# Altium project FIT_PM_Digital_Readout_test_board.PrjPcb (part 2 of 4)

## Sheet ADC5G_DIGITALIO.SchDoc: FMC 5GS/s ADC/TDC
size 420 x 297 mm; Author: Agnieszka Bartkowicz; CompanyName: WUT ISE; DrawnBy: Agnieszka Bartkowicz; Engineer: Agnieszka Bartkowicz; Organization: WUT ISE; Address1: PW ISE; Address2: Nowowiejska 15/19 00-665 Warsaw; Address3: gyorka@o2.pl; SheetNumber: 4; SheetTotal: 13; ModifiedBy: -; CheckedDate: -; Title2: Title 2; DivGrp: WUT ISE; Designer: A. Bartkowicz
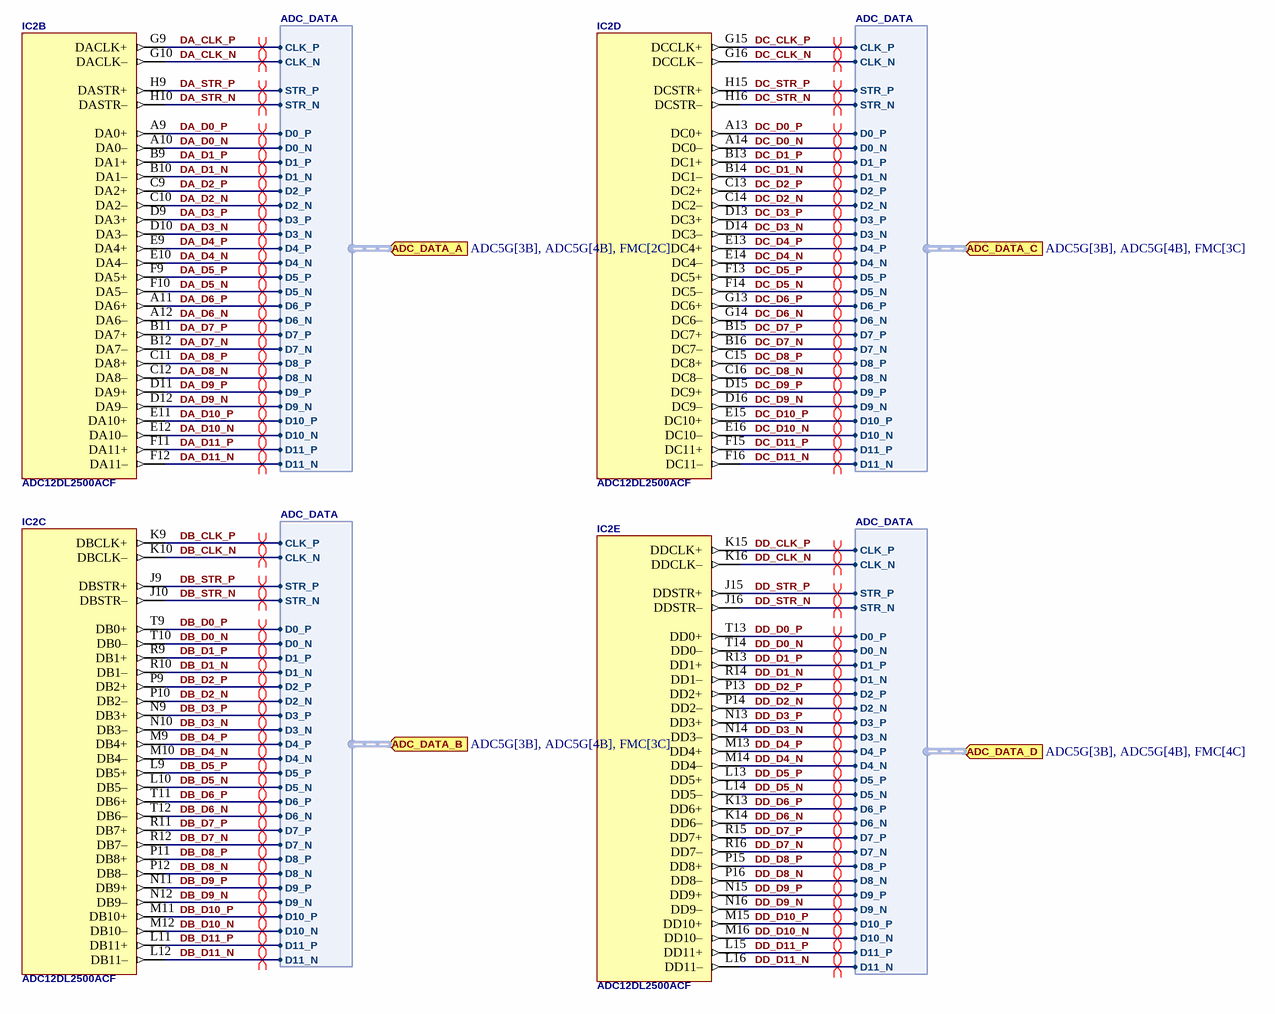
[diagram p4: ADC5G_DIGITALIO.SchDoc]

### Parts
IC2  ADC12DL2500ACF  [BGA256C100P16X16_1700X1700X331]  (parts B,C,D,E of 7)

### Ports
ADC_DATA_A (in, harness ADC_DATA, see ADC5G[3B], ADC5G[4B], FMC[2C]), ADC_DATA_B (in, harness ADC_DATA, see ADC5G[3B], ADC5G[4B], FMC[3C]), ADC_DATA_C (in, harness ADC_DATA, see ADC5G[3B], ADC5G[4B], FMC[3C]), ADC_DATA_D (in, harness ADC_DATA, see ADC5G[3B], ADC5G[4B], FMC[4C])

### Harnesses
ADC_DATA: CLK_P, CLK_N, STR_P, STR_N, D0_P, D1_P, D2_P, D3_P, D4_P, D5_P, D6_P, D7_P, D8_P, D9_P, D10_P, D11_P, D11_N, D10_N, D9_N, D8_N, D7_N, D6_N, D5_N, D4_N, D3_N, D2_N, D1_N, D0_N

### Nets
DA_CLK_N: IC2.G10(DACLK–) ; port ADC_DATA_A.CLK_N
DA_CLK_P: IC2.G9(DACLK+) ; port ADC_DATA_A.CLK_P
DA_D0_N: IC2.A10(DA0–) ; port ADC_DATA_A.D0_N
DA_D0_P: IC2.A9(DA0+) ; port ADC_DATA_A.D0_P
DA_D1_N: IC2.B10(DA1–) ; port ADC_DATA_A.D1_N
DA_D1_P: IC2.B9(DA1+) ; port ADC_DATA_A.D1_P
DA_D2_N: IC2.C10(DA2–) ; port ADC_DATA_A.D2_N
DA_D2_P: IC2.C9(DA2+) ; port ADC_DATA_A.D2_P
DA_D3_N: IC2.D10(DA3–) ; port ADC_DATA_A.D3_N
DA_D3_P: IC2.D9(DA3+) ; port ADC_DATA_A.D3_P
DA_D4_N: IC2.E10(DA4–) ; port ADC_DATA_A.D4_N
DA_D4_P: IC2.E9(DA4+) ; port ADC_DATA_A.D4_P
DA_D5_N: IC2.F10(DA5–) ; port ADC_DATA_A.D5_N
DA_D5_P: IC2.F9(DA5+) ; port ADC_DATA_A.D5_P
DA_D6_N: IC2.A12(DA6–) ; port ADC_DATA_A.D6_N
DA_D6_P: IC2.A11(DA6+) ; port ADC_DATA_A.D6_P
DA_D7_N: IC2.B12(DA7–) ; port ADC_DATA_A.D7_N
DA_D7_P: IC2.B11(DA7+) ; port ADC_DATA_A.D7_P
DA_D8_N: IC2.C12(DA8–) ; port ADC_DATA_A.D8_N
DA_D8_P: IC2.C11(DA8+) ; port ADC_DATA_A.D8_P
DA_D9_N: IC2.D12(DA9–) ; port ADC_DATA_A.D9_N
DA_D9_P: IC2.D11(DA9+) ; port ADC_DATA_A.D9_P
DA_D10_N: IC2.E12(DA10–) ; port ADC_DATA_A.D10_N
DA_D10_P: IC2.E11(DA10+) ; port ADC_DATA_A.D10_P
DA_D11_N: IC2.F12(DA11–) ; port ADC_DATA_A.D11_N
DA_D11_P: IC2.F11(DA11+) ; port ADC_DATA_A.D11_P
DA_STR_N: IC2.H10(DASTR–) ; port ADC_DATA_A.STR_N
DA_STR_P: IC2.H9(DASTR+) ; port ADC_DATA_A.STR_P
DB_CLK_N: IC2.K10(DBCLK–) ; port ADC_DATA_B.CLK_N
DB_CLK_P: IC2.K9(DBCLK+) ; port ADC_DATA_B.CLK_P
DB_D0_N: IC2.T10(DB0–) ; port ADC_DATA_B.D0_N
DB_D0_P: IC2.T9(DB0+) ; port ADC_DATA_B.D0_P
DB_D1_N: IC2.R10(DB1–) ; port ADC_DATA_B.D1_N
DB_D1_P: IC2.R9(DB1+) ; port ADC_DATA_B.D1_P
DB_D2_N: IC2.P10(DB2–) ; port ADC_DATA_B.D2_N
DB_D2_P: IC2.P9(DB2+) ; port ADC_DATA_B.D2_P
DB_D3_N: IC2.N10(DB3–) ; port ADC_DATA_B.D3_N
DB_D3_P: IC2.N9(DB3+) ; port ADC_DATA_B.D3_P
DB_D4_N: IC2.M10(DB4–) ; port ADC_DATA_B.D4_N
DB_D4_P: IC2.M9(DB4+) ; port ADC_DATA_B.D4_P
DB_D5_N: IC2.L10(DB5–) ; port ADC_DATA_B.D5_N
DB_D5_P: IC2.L9(DB5+) ; port ADC_DATA_B.D5_P
DB_D6_N: IC2.T12(DB6–) ; port ADC_DATA_B.D6_N
DB_D6_P: IC2.T11(DB6+) ; port ADC_DATA_B.D6_P
DB_D7_N: IC2.R12(DB7–) ; port ADC_DATA_B.D7_N
DB_D7_P: IC2.R11(DB7+) ; port ADC_DATA_B.D7_P
DB_D8_N: IC2.P12(DB8–) ; port ADC_DATA_B.D8_N
DB_D8_P: IC2.P11(DB8+) ; port ADC_DATA_B.D8_P
DB_D9_N: IC2.N12(DB9–) ; port ADC_DATA_B.D9_N
DB_D9_P: IC2.N11(DB9+) ; port ADC_DATA_B.D9_P
DB_D10_N: IC2.M12(DB10–) ; port ADC_DATA_B.D10_N
DB_D10_P: IC2.M11(DB10+) ; port ADC_DATA_B.D10_P
DB_D11_N: IC2.L12(DB11–) ; port ADC_DATA_B.D11_N
DB_D11_P: IC2.L11(DB11+) ; port ADC_DATA_B.D11_P
DB_STR_N: IC2.J10(DBSTR–) ; port ADC_DATA_B.STR_N
DB_STR_P: IC2.J9(DBSTR+) ; port ADC_DATA_B.STR_P
DC_CLK_N: IC2.G16(DCCLK–) ; port ADC_DATA_C.CLK_N
DC_CLK_P: IC2.G15(DCCLK+) ; port ADC_DATA_C.CLK_P
DC_D0_N: IC2.A14(DC0–) ; port ADC_DATA_C.D0_N
DC_D0_P: IC2.A13(DC0+) ; port ADC_DATA_C.D0_P
DC_D1_N: IC2.B14(DC1–) ; port ADC_DATA_C.D1_N
DC_D1_P: IC2.B13(DC1+) ; port ADC_DATA_C.D1_P
DC_D2_N: IC2.C14(DC2–) ; port ADC_DATA_C.D2_N
DC_D2_P: IC2.C13(DC2+) ; port ADC_DATA_C.D2_P
DC_D3_N: IC2.D14(DC3–) ; port ADC_DATA_C.D3_N
DC_D3_P: IC2.D13(DC3+) ; port ADC_DATA_C.D3_P
DC_D4_N: IC2.E14(DC4–) ; port ADC_DATA_C.D4_N
DC_D4_P: IC2.E13(DC4+) ; port ADC_DATA_C.D4_P
DC_D5_N: IC2.F14(DC5–) ; port ADC_DATA_C.D5_N
DC_D5_P: IC2.F13(DC5+) ; port ADC_DATA_C.D5_P
DC_D6_N: IC2.G14(DC6–) ; port ADC_DATA_C.D6_N
DC_D6_P: IC2.G13(DC6+) ; port ADC_DATA_C.D6_P
DC_D7_N: IC2.B16(DC7–) ; port ADC_DATA_C.D7_N
DC_D7_P: IC2.B15(DC7+) ; port ADC_DATA_C.D7_P
DC_D8_N: IC2.C16(DC8–) ; port ADC_DATA_C.D8_N
DC_D8_P: IC2.C15(DC8+) ; port ADC_DATA_C.D8_P
DC_D9_N: IC2.D16(DC9–) ; port ADC_DATA_C.D9_N
DC_D9_P: IC2.D15(DC9+) ; port ADC_DATA_C.D9_P
DC_D10_N: IC2.E16(DC10–) ; port ADC_DATA_C.D10_N
DC_D10_P: IC2.E15(DC10+) ; port ADC_DATA_C.D10_P
DC_D11_N: IC2.F16(DC11–) ; port ADC_DATA_C.D11_N
DC_D11_P: IC2.F15(DC11+) ; port ADC_DATA_C.D11_P
DC_STR_N: IC2.H16(DCSTR–) ; port ADC_DATA_C.STR_N
DC_STR_P: IC2.H15(DCSTR+) ; port ADC_DATA_C.STR_P
DD_CLK_N: IC2.K16(DDCLK–) ; port ADC_DATA_D.CLK_N
DD_CLK_P: IC2.K15(DDCLK+) ; port ADC_DATA_D.CLK_P
DD_D0_N: IC2.T14(DD0–) ; port ADC_DATA_D.D0_N
DD_D0_P: IC2.T13(DD0+) ; port ADC_DATA_D.D0_P
DD_D1_N: IC2.R14(DD1–) ; port ADC_DATA_D.D1_N
DD_D1_P: IC2.R13(DD1+) ; port ADC_DATA_D.D1_P
DD_D2_N: IC2.P14(DD2–) ; port ADC_DATA_D.D2_N
DD_D2_P: IC2.P13(DD2+) ; port ADC_DATA_D.D2_P
DD_D3_N: IC2.N14(DD3–) ; port ADC_DATA_D.D3_N
DD_D3_P: IC2.N13(DD3+) ; port ADC_DATA_D.D3_P
DD_D4_N: IC2.M14(DD4–) ; port ADC_DATA_D.D4_N
DD_D4_P: IC2.M13(DD4+) ; port ADC_DATA_D.D4_P
DD_D5_N: IC2.L14(DD5–) ; port ADC_DATA_D.D5_N
DD_D5_P: IC2.L13(DD5+) ; port ADC_DATA_D.D5_P
DD_D6_N: IC2.K14(DD6–) ; port ADC_DATA_D.D6_N
DD_D6_P: IC2.K13(DD6+) ; port ADC_DATA_D.D6_P
DD_D7_N: IC2.R16(DD7–) ; port ADC_DATA_D.D7_N
DD_D7_P: IC2.R15(DD7+) ; port ADC_DATA_D.D7_P
DD_D8_N: IC2.P16(DD8–) ; port ADC_DATA_D.D8_N
DD_D8_P: IC2.P15(DD8+) ; port ADC_DATA_D.D8_P
DD_D9_N: IC2.N16(DD9–) ; port ADC_DATA_D.D9_N
DD_D9_P: IC2.N15(DD9+) ; port ADC_DATA_D.D9_P
DD_D10_N: IC2.M16(DD10–) ; port ADC_DATA_D.D10_N
DD_D10_P: IC2.M15(DD10+) ; port ADC_DATA_D.D10_P
DD_D11_N: IC2.L16(DD11–) ; port ADC_DATA_D.D11_N
DD_D11_P: IC2.L15(DD11+) ; port ADC_DATA_D.D11_P
DD_STR_N: IC2.J16(DDSTR–) ; port ADC_DATA_D.STR_N
DD_STR_P: IC2.J15(DDSTR+) ; port ADC_DATA_D.STR_P

### Layout directives
differential pair: DA_CLK_N, DA_CLK_P, DA_D0_N, DA_D0_P, DA_D1_N, DA_D1_P, DA_D2_N, DA_D2_P, DA_D3_N, DA_D3_P, DA_D4_N, DA_D4_P, DA_D5_N, DA_D5_P, DA_D6_N, DA_D6_P, DA_D7_N, DA_D7_P, DA_D8_N, DA_D8_P, DA_D9_N, DA_D9_P, DA_D10_N, DA_D10_P, DA_D11_N, DA_D11_P, DA_STR_N, DA_STR_P, DB_CLK_N, DB_CLK_P, DB_D0_N, DB_D0_P, DB_D1_N, DB_D1_P, DB_D2_N, DB_D2_P, DB_D3_N, DB_D3_P, DB_D4_N, DB_D4_P, DB_D5_N, DB_D5_P, DB_D6_N, DB_D6_P, DB_D7_N, DB_D7_P, DB_D8_N, DB_D8_P, DB_D9_N, DB_D9_P, DB_D10_N, DB_D10_P, DB_D11_N, DB_D11_P, DB_STR_N, DB_STR_P, DC_CLK_N, DC_CLK_P, DC_D0_N, DC_D0_P, DC_D1_N, DC_D1_P, DC_D2_N, DC_D2_P, DC_D3_N, DC_D3_P, DC_D4_N, DC_D4_P, DC_D5_N, DC_D5_P, DC_D6_N, DC_D6_P, DC_D7_N, DC_D7_P, DC_D8_N, DC_D8_P, DC_D9_N, DC_D9_P, DC_D10_N, DC_D10_P, DC_D11_N, DC_D11_P, DC_STR_N, DC_STR_P, DD_CLK_N, DD_CLK_P, DD_D0_N, DD_D0_P, DD_D1_N, DD_D1_P, DD_D2_N, DD_D2_P, DD_D3_N, DD_D3_P, DD_D4_N, DD_D4_P, DD_D5_N, DD_D5_P, DD_D6_N, DD_D6_P, DD_D7_N, DD_D7_P, DD_D8_N, DD_D8_P, DD_D9_N, DD_D9_P, DD_D10_N, DD_D10_P, DD_D11_N, DD_D11_P, DD_STR_N, DD_STR_P

### Notes on the sheet
- Project/Equipment
- Document
- Designer
- Drawn by
- Check.by
- Copyright WUT ISE 2024.
  This documentation describes Open Hardware and is licensed under the CERN OHL v.2. You may redistribute and modify this documentation under the terms of the CERN OHL v.2. (http://ohwr.org/CERNOHL). This documentation is distributed WITHOUT ANY EXPRESS OR IMPLIED WARRANTY, INCLUDING OF MERCHANTABILITY, SATISFACTORY QUALITY AND FITNESS FOR A PARTICULAR PURPOSE. Please see the CERN OHL v.2 for applicable conditions.
- Contact
- File
- Last Mod.
- Print Date
- Sheet
- Size
- A3
- of
- Rev

### Library data of the parts
IC2 = ADC12DL2500ACF: Single-Supply, Multichannel, 125kSPS, 24-Bit, Sigma-Delta ADC with ±10V Inputs; Part Description: 1.5 GSPS Dual-Channel or 1, 3, 5GSPS Single-Channel,12-Bit Analog-to-Digital Converters (ADC) With LVDS Interface; Manufacturer: TEXAS INSTRUMENTS; PressFit: No; Bonding: No; Part Number: ADC12DL2500ACF; Component Kind: Standard; Component Type: Standard; Device: ADC12DL2500ACF; PackageDescription: BGA, 1.00mm Pitch, Square; 156 Pin, 16 Columns X 16 Rows, 17.0mm X 17.0mm X 3.31mm H body, IPC Medium Density; Manufacturer Part Number: ADC12DL2500ACF; Pin Count: 256; Case: BGA256; Mounted: Yes; Socket: No; SMD: Yes; Sense: No; ComponentHeight: 3.31mm; Author: CERN DEM HF; HelpURL: \\cern.ch\dfs\Applications\Altium\Datasheets\ADC12DLX500ACF.pdf; CreateDate: 04.12.2024; LatestRevisionDate: 04.12.2024

## Sheet ADC5G_PLL.SchDoc: FMC 5GS/s ADC/TDC
size 420 x 297 mm; Author: Agnieszka Bartkowicz; CompanyName: WUT ISE; DrawnBy: Agnieszka Bartkowicz; Engineer: Agnieszka Bartkowicz; Organization: WUT ISE; Address1: PW ISE; Address2: Nowowiejska 15/19 00-665 Warsaw; Address3: gyorka@o2.pl; SheetNumber: 9; SheetTotal: 13; ModifiedBy: -; CheckedDate: -; Title2: Title 2; DivGrp: WUT ISE; Designer: A. Bartkowicz
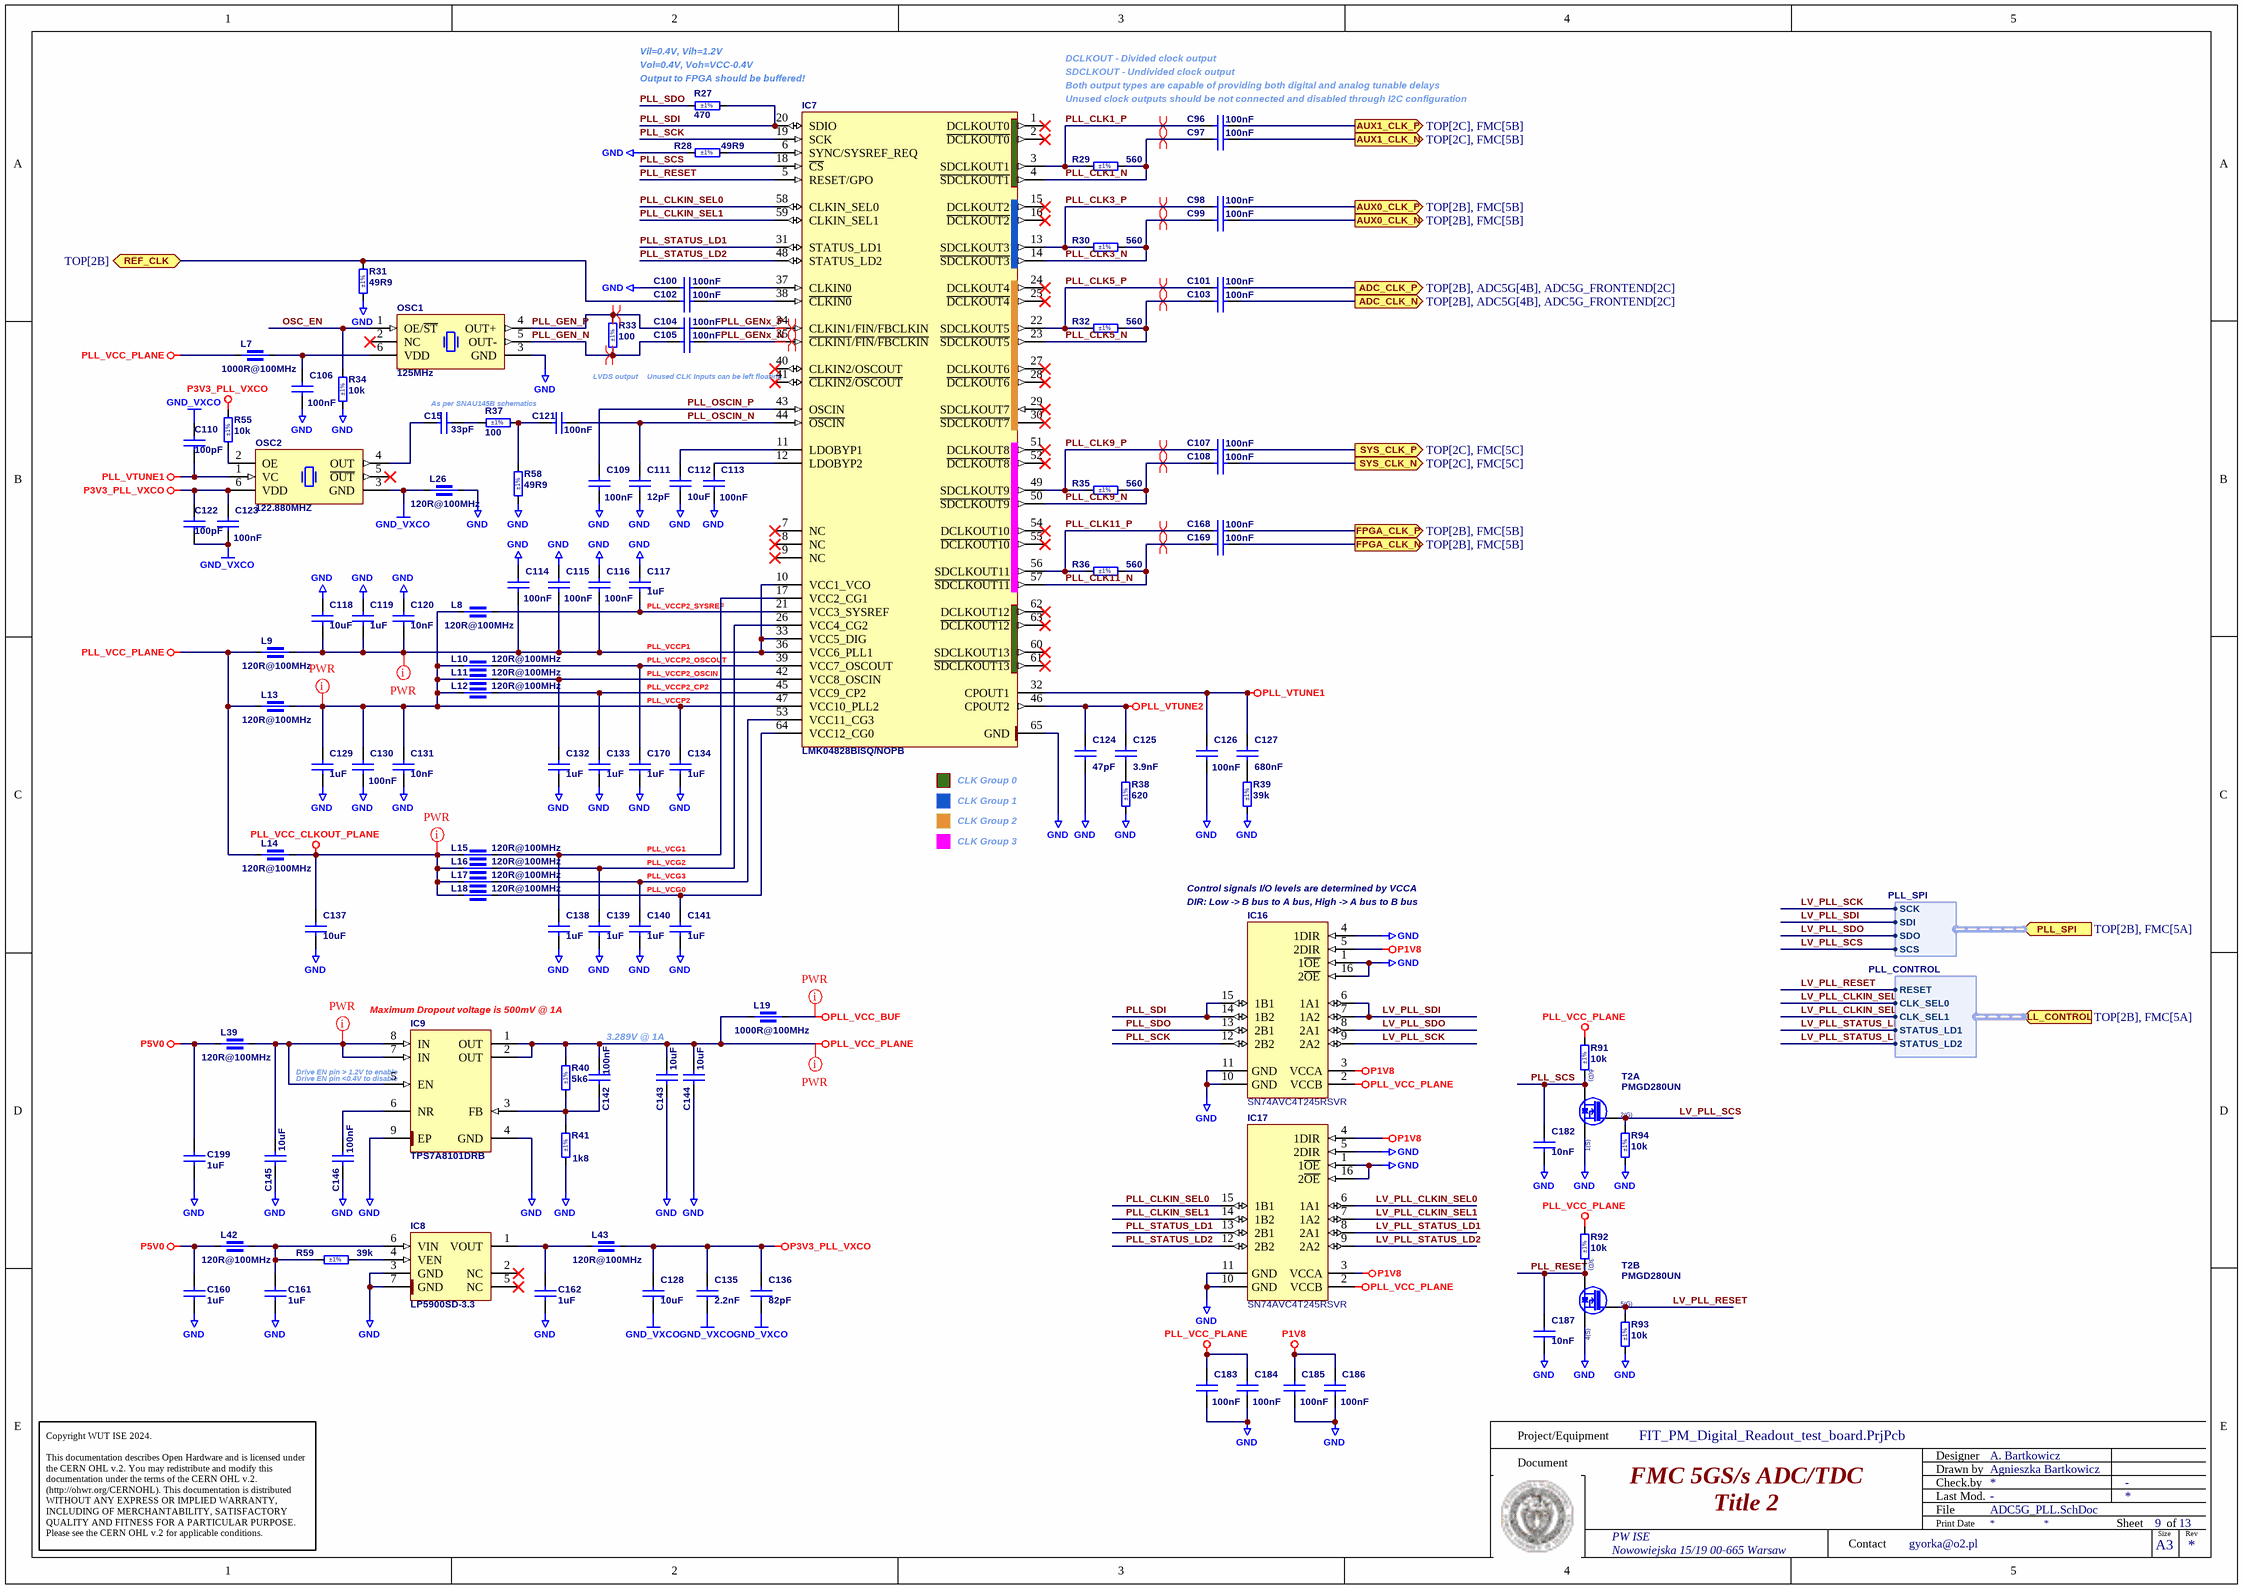
[diagram p5: ADC5G_PLL.SchDoc]

### Parts
C15  33pF  [CAPC1005X61N]
C96  100nF  [CAPC1005X55N]
C97  100nF  [CAPC1005X55N]
C98  100nF  [CAPC1005X55N]
C99  100nF  [CAPC1005X55N]
C100  100nF  [CAPC1005X55N]
C101  100nF  [CAPC1005X55N]
C102  100nF  [CAPC1005X55N]
C103  100nF  [CAPC1005X55N]
C104  100nF  [CAPC1005X55N]
C105  100nF  [CAPC1005X55N]
C106  100nF  [CAPC1005X55N]
C107  100nF  [CAPC1005X55N]
C108  100nF  [CAPC1005X55N]
C109  100nF  [CAPC1005X55N]
C110  100pF  [CAPC1005X55N]
C111  12pF  [CAPC1005X61N]
C112  10uF  [CAPC1608X90N]
C113  100nF  [CAPC1005X55N]
C114  100nF  [CAPC1005X55N]
C115  100nF  [CAPC1005X55N]
C116  100nF  [CAPC1005X55N]
C117  1uF  [CAPC1005X55N]
C118  10uF  [CAPC1608X90N]
C119  1uF  [CAPC1005X55N]
C120  10nF  [CAPC1005X55N]
C121  100nF  [CAPC1005X55N]
C122  100pF  [CAPC1005X55N]
C123  100nF  [CAPC1005X55N]
C124  47pF  [CAPC1005X55N]
C125  3.9nF  [CAPC1005X55N]
C126  100nF  [CAPC1005X55N]
C127  680nF  [CAPC1005X55N]
C128  10uF  [CAPC1608X90N]
C129  1uF  [CAPC1005X55N]
C130  100nF  [CAPC1005X55N]
C131  10nF  [CAPC1005X55N]
C132  1uF  [CAPC1005X55N]
C133  1uF  [CAPC1005X55N]
C134  1uF  [CAPC1005X55N]
C135  2.2nF  [CAPC1005X55N]
C136  82pF  [CAPC1005X55N]
C137  10uF  [CAPC1608X90N]
C138  1uF  [CAPC1005X55N]
C139  1uF  [CAPC1005X55N]
C140  1uF  [CAPC1005X55N]
C141  1uF  [CAPC1005X55N]
C142  100nF  [CAPC1005X55N]
C143  10uF  [CAPC1608X90N]
C144  10uF  [CAPC1608X90N]
C145  10uF  [CAPC1608X90N]
C146  100nF  [CAPC1005X55N]
C160  1uF  [CAPC1005X55N]
C161  1uF  [CAPC1005X55N]
C162  1uF  [CAPC1005X55N]
C168  100nF  [CAPC1005X55N]
C169  100nF  [CAPC1005X55N]
C170  1uF  [CAPC1005X55N]
C182  10nF  [CAPC1005X55N]
C183  100nF  [CAPC1005X55N]
C184  100nF  [CAPC1005X55N]
C185  100nF  [CAPC1005X55N]
C186  100nF  [CAPC1005X55N]
C187  10nF  [CAPC1005X55N]
C199  1uF  [CAPC1005X55N]
IC7  LMK04828BISQ/NOPB  [QFN50P900X900X80-65N-S730]
IC8  LP5900SD-3.3  [SON65P250X220X80-7N-R85X130]
IC9  TPS7A8101DRB  [TEXAS_DRB(S-PVSON-N8)]
IC16  SN74AVC4T245RSVR  [QFN40P180X260X55-16N]
IC17  SN74AVC4T245RSVR  [QFN40P180X260X55-16N]
L7  1000R@100MHz  [INDC1608X95N]
L8  120R@100MHz  [INDC1005X55N]
L9  120R@100MHz  [INDC1005X55N]
L10  120R@100MHz  [INDC1005X55N]
L11  120R@100MHz  [INDC1005X55N]
L12  120R@100MHz  [INDC1005X55N]
L13  120R@100MHz  [INDC1005X55N]
L14  120R@100MHz  [INDC1005X55N]
L15  120R@100MHz  [INDC1005X55N]
L16  120R@100MHz  [INDC1005X55N]
L17  120R@100MHz  [INDC1005X55N]
L18  120R@100MHz  [INDC1005X55N]
L19  1000R@100MHz  [INDC1608X95N]
L26  120R@100MHz  [INDC1005X55N]
L39  120R@100MHz  [INDC1005X55N]
L42  120R@100MHz  [INDC1005X55N]
L43  120R@100MHz  [INDC1005X55N]
OSC1  125MHz  [OSC_SI-TIME_SIT9121-C]
OSC2  122.880MHZ  [OSCSC254P500X700X190-6N]
R27  470  Tolerance: ±1%  [RESC1005X40N]
R28  49R9  Tolerance: ±1%  [RESC1005X40N]
R29  560  Tolerance: ±1%  [RESC1005X40N]
R30  560  Tolerance: ±1%  [RESC1005X40N]
R31  49R9  Tolerance: ±1%  [RESC1005X40N]
R32  560  Tolerance: ±1%  [RESC1005X40N]
R33  100  Tolerance: ±1%  [RESC1005X40N]
R34  10k  Tolerance: ±1%  [RESC1005X40N]
R35  560  Tolerance: ±1%  [RESC1005X40N]
R36  560  Tolerance: ±1%  [RESC1005X40N]
R37  100  Tolerance: ±1%  [RESC1005X40N]
R38  620  Tolerance: ±1%  [RESC1005X40N]
R39  39k  Tolerance: ±1%  [RESC1005X40N]
R40  5k6  Tolerance: ±1%  [RESC1005X40N]
R41  1k8  Tolerance: ±1%  [RESC1005X40N]
R55  10k  Tolerance: ±1%  [RESC1005X40N]
R58  49R9  Tolerance: ±1%  [RESC1005X40N]
R59  39k  Tolerance: ±1%  [RESC1005X40N]
R91  10k  Tolerance: ±1%  [RESC1005X40N]
R92  10k  Tolerance: ±1%  [RESC1005X40N]
R93  10k  Tolerance: ±1%  [RESC1005X40N]
R94  10k  Tolerance: ±1%  [RESC1005X40N]
T2  PMGD280UN  [SOT65P210X110-6N]  (parts A,B of 2)

### Ports
ADC_CLK_N (out, see TOP[2B], ADC5G[4B], ADC5G_FRONTEND[2C]), ADC_CLK_P (out, see TOP[2B], ADC5G[4B], ADC5G_FRONTEND[2C]), AUX0_CLK_N (out, see TOP[2B], FMC[5B]), AUX0_CLK_P (out, see TOP[2B], FMC[5B]), AUX1_CLK_N (out, see TOP[2C], FMC[5B]), AUX1_CLK_P (out, see TOP[2C], FMC[5B]), FPGA_CLK_N (out, see TOP[2B], FMC[5B]), FPGA_CLK_P (out, see TOP[2B], FMC[5B]), PLL_CONTROL (in, harness PLL_CONTROL, see TOP[2B], FMC[5A]), PLL_SPI (in, harness PLL_SPI, see TOP[2B], FMC[5A]), REF_CLK (bidir, see TOP[2B]), SYS_CLK_N (out, see TOP[2C], FMC[5C]), SYS_CLK_P (out, see TOP[2C], FMC[5C])

### Harnesses
PLL_SPI: SCK, SDI, SDO, SCS
PLL_CONTROL: RESET, CLK_SEL0, CLK_SEL1, STATUS_LD1, STATUS_LD2

### Nets
GND: C100.1 C106.1 C109.1 C111.1 C112.1 C113.1 C114.2 C115.2 C116.2 C117.2 C118.2 C119.2 C120.2 C124.1 C126.1 C129.1 C130.1 C131.1 C132.1 C133.1 C134.1 C137.1 C138.1 C139.1 C140.1 C141.1 C143.1 C144.1 C145.1 C146.1 C160.1 C161.1 C162.1 C170.1 C182.1 C183.1 C184.1 C185.1 C186.1 C187.1 C199.1 IC7.65(GND) IC8.3(GND) IC8.7(GND) IC9.4(GND) IC9.9(EP) IC16.1(1~{OE}) IC16.4(1DIR) IC16.10(GND) IC16.11(GND) IC16.16(2~{OE}) IC17.1(1~{OE}) IC17.5(2DIR) IC17.10(GND) IC17.11(GND) IC17.16(2~{OE}) L26.2 OSC1.3(GND) R28.1 R31.1 R34.1 R38.1 R39.1 R41.1 R58.1 R93.1 R94.1 T2.1(S) T2.4(S)
GND_VXCO: C110.2 C122.1 C123.1 C128.1 C135.1 C136.1 L26.1 OSC2.3(GND)
P1V8: C185.2 C186.2 IC16.3(VCCA) IC16.5(2DIR) IC17.3(VCCA) IC17.4(1DIR)
P3V3_PLL_VXCO: C122.2 C123.2 C128.2 C135.2 C136.2 L43.2 OSC2.6(VDD) R55.2
P5V0: C160.2 C199.2 L39.1 L42.1
PLL_VCC_BUF: L19.2
PLL_VCC_CLKOUT_PLANE: C137.2 L14.2 L15.1 L16.1 L17.1 L18.1
PLL_VCC_PLANE: C142.2 C143.2 C144.2 C183.2 C184.2 IC9.1(OUT) IC9.2(OUT) IC16.2(VCCB) IC17.2(VCCB) L7.1 L9.1 L13.1 L14.1 L19.1 R40.2 R91.2 R92.2
PLL_VTUNE1: C110.1 C126.2 C127.2 IC7.32(CPOUT1) OSC2.1(VC)
PLL_VTUNE2: C124.2 C125.2 IC7.46(CPOUT2)
ADC_CLK_N: C103.2 ; port ADC_CLK_N
ADC_CLK_P: C101.2 ; port ADC_CLK_P
CLK0_M2C_N: C99.2 ; port AUX0_CLK_N
CLK0_M2C_P: C98.2 ; port AUX0_CLK_P
CLK1_M2C_N: C97.2 ; port AUX1_CLK_N
CLK1_M2C_P: C96.2 ; port AUX1_CLK_P
CLK2_BIDIR_N: C108.2 ; port SYS_CLK_N
CLK2_BIDIR_P: C107.2 ; port SYS_CLK_P
GBTCLK0_M2C_N: C169.2 ; port FPGA_CLK_N
GBTCLK0_M2C_P: C168.2 ; port FPGA_CLK_P
LV_PLL_CLKIN_SEL0: IC17.6(1A1) ; port PLL_CONTROL.CLK_SEL0  [project net HA19_N]
LV_PLL_CLKIN_SEL1: IC17.7(1A2) ; port PLL_CONTROL.CLK_SEL1  [project net HA19_P]
LV_PLL_RESET: R93.2 T2.5(G) ; port PLL_CONTROL.RESET  [project net HA18_P]
LV_PLL_SCK: IC16.9(2A2) ; port PLL_SPI.SCK  [project net HA17_CC_P]
LV_PLL_SCS: R94.2 T2.2(G) ; port PLL_SPI.SCS  [project net HA21_P]
LV_PLL_SDI: IC16.6(1A1) IC16.7(1A2) ; port PLL_SPI.SDI  [project net HA14_P]
LV_PLL_SDO: IC16.8(2A1) ; port PLL_SPI.SDO  [project net HA15_P]
LV_PLL_STATUS_LD1: IC17.8(2A1) ; port PLL_CONTROL.STATUS_LD1  [project net HA20_P]
LV_PLL_STATUS_LD2: IC17.9(2A2) ; port PLL_CONTROL.STATUS_LD2  [project net HA20_N]
OSC_EN: OSC1.1(OE/~{ST}) R34.2
PLL_CLK1_N: C97.1 IC7.4(~{SDCLKOUT1}) R29.2
PLL_CLK1_P: C96.1 IC7.3(SDCLKOUT1) R29.1
PLL_CLK3_N: C99.1 IC7.14(~{SDCLKOUT3}) R30.2
PLL_CLK3_P: C98.1 IC7.13(SDCLKOUT3) R30.1
PLL_CLK5_N: C103.1 IC7.23(~{SDCLKOUT5}) R32.2
PLL_CLK5_P: C101.1 IC7.22(SDCLKOUT5) R32.1
PLL_CLK9_N: C108.1 IC7.50(~{SDCLKOUT9}) R35.2
PLL_CLK9_P: C107.1 IC7.49(SDCLKOUT9) R35.1
PLL_CLK11_N: C169.1 IC7.57(~{SDCLKOUT11}) R36.2
PLL_CLK11_P: C168.1 IC7.56(SDCLKOUT11) R36.1
PLL_CLKIN_SEL0: IC7.58(CLKIN_SEL0) IC17.15(1B1)
PLL_CLKIN_SEL1: IC7.59(CLKIN_SEL1) IC17.14(1B2)
PLL_GEN_N: C105.1 OSC1.5(OUT-) R33.1
PLL_GEN_P: C104.1 OSC1.4(OUT+) R33.2
PLL_GENx_N: C105.2 IC7.35(~{CLKIN1}/~{FIN}/~{FBCLKIN})
PLL_GENx_P: C104.2 IC7.34(CLKIN1/FIN/FBCLKIN)
PLL_OSCIN_N: C111.2 C121.1 IC7.44(~{OSCIN})
PLL_OSCIN_P: C109.2 IC7.43(OSCIN)
PLL_RESET: C187.2 IC7.5(RESET/GPO) R92.1 T2.3(D)
PLL_SCK: IC7.19(SCK) IC16.12(2B2)
PLL_SCS: C182.2 IC7.18(~{CS}) R91.1 T2.6(D)
PLL_SDI: IC7.20(SDIO) IC16.14(1B2) IC16.15(1B1) R27.2
PLL_SDO: IC16.13(2B1) R27.1
PLL_STATUS_LD1: IC7.31(STATUS_LD1) IC17.13(2B1)
PLL_STATUS_LD2: IC7.48(STATUS_LD2) IC17.12(2B2)
PLL_VCCP1: C114.1 C115.1 C116.1 C118.1 C119.1 C120.1 IC7.10(VCC1_VCO) IC7.33(VCC5_DIG) IC7.36(VCC6_PLL1) L9.2
PLL_VCCP2: C129.2 C130.2 C131.2 C134.2 IC7.47(VCC10_PLL2) L8.1 L10.1 L11.1 L12.1 L13.2
PLL_VCCP2_CP2: C133.2 IC7.45(VCC9_CP2) L12.2
PLL_VCCP2_OSCIN: C132.2 IC7.42(VCC8_OSCIN) L11.2
PLL_VCCP2_OSCOUT: C170.2 IC7.39(VCC7_OSCOUT) L10.2
PLL_VCCP2_SYSREF: C117.1 IC7.21(VCC3_SYSREF) L8.2
PLL_VCG0: C141.2 IC7.64(VCC12_CG0) L18.2
PLL_VCG1: C138.2 IC7.17(VCC2_CG1) L15.2
PLL_VCG2: C139.2 IC7.26(VCC4_CG2) L16.2
PLL_VCG3: C140.2 IC7.53(VCC11_CG3) L17.2
NetC15_1: C15.1 OSC2.4(OUT)
NetC15_2: C15.2 R37.1
NetC100_2: C100.2 IC7.37(CLKIN0)
NetC102_1: C102.1 R31.2 ; port REF_CLK
NetC102_2: C102.2 IC7.38(~{CLKIN0})
NetC106_2: C106.2 L7.2 OSC1.6(VDD)
NetC112_2: C112.2 IC7.11(LDOBYP1)
NetC113_2: C113.2 IC7.12(LDOBYP2)
NetC121_2: C121.2 R37.2 R58.2
NetC125_1: C125.1 R38.2
NetC127_1: C127.1 R39.2
NetC142_1: C142.1 IC9.3(FB) R40.1 R41.2
NetC145_2: C145.2 IC9.5(EN) IC9.7(IN) IC9.8(IN) L39.2
NetC146_2: C146.2 IC9.6(NR)
NetC161_2: C161.2 IC8.6(VIN) L42.2 R59.2
NetC162_2: C162.2 IC8.1(VOUT) L43.1
NetIC7_6: IC7.6(SYNC/SYSREF_REQ) R28.2
NetIC8_4: IC8.4(VEN) R59.1
NetOSC2_2: OSC2.2(OE) R55.1

Not connected (* = marked no-connect by the designer): IC7 1(DCLKOUT0)* 2(~{DCLKOUT0})* 7(NC)* 8(NC)* 9(NC)* 15(DCLKOUT2)* 16(~{DCLKOUT2})* 24(DCLKOUT4)* 25(~{DCLKOUT4})* 27(DCLKOUT6)* 28(~{DCLKOUT6})* 29(SDCLKOUT7)* 30(~{SDCLKOUT7})* 40(CLKIN2/OSCOUT)* 41(~{CLKIN2}/~{OSCOUT})* 51(DCLKOUT8)* 52(~{DCLKOUT8})* 54(DCLKOUT10)* 55(~{DCLKOUT10})* 60(SDCLKOUT13)* 61(~{SDCLKOUT13})* 62(DCLKOUT12)* 63(~{DCLKOUT12})*; IC8 2(NC)* 5(NC)*; OSC1 2(NC)*; OSC2 5(~{OUT})*

### Layout directives
net class PWR: NetC145_2, PLL_VCC_BUF, PLL_VCC_CLKOUT_PLANE, PLL_VCC_PLANE, PLL_VCCP1, PLL_VCCP2
differential pair: PLL_CLK1_N, PLL_CLK1_P, PLL_CLK3_N, PLL_CLK3_P, PLL_CLK5_N, PLL_CLK5_P, PLL_CLK9_N, PLL_CLK9_P, PLL_CLK11_N, PLL_CLK11_P, PLL_GEN_N, PLL_GEN_P, PLL_GENx_N, PLL_GENx_P

### Notes on the sheet
- (near R27) Vil=0.4V, Vih=1.2V
- (near R27) Vol=0.4V, Voh=VCC-0.4V
- (near R27) Output to FPGA should be buffered!
- DCLKOUT - Divided clock output
- SDCLKOUT - Undivided clock output
- Both output types are capable of providing both digital and analog tunable delays
- Unused clock outputs should be not connected and disabled through I2C configuration
- (near R33) LVDS output
- (near IC7) Unused CLK Inputs can be left floating
- As per SNAU145B schematics
- (near IC7) CLK Group 0
- CLK Group 1
- CLK Group 2
- CLK Group 3
- (near IC16) Control signals I/O levels are determined by VCCA
- (near IC16) DIR: Low -> B bus to A bus, High -> A bus to B bus
- (near IC9) Drive EN pin > 1.2V to enable
- (near IC9) Maximum Dropout voltage is 500mV @ 1A
- 3.289V @ 1A
- (near IC9) Drive EN pin <0.4V to disable
- Project/Equipment
- Document
- Designer
- Drawn by
- Check.by
- Copyright WUT ISE 2024.
  This documentation describes Open Hardware and is licensed under the CERN OHL v.2. You may redistribute and modify this documentation under the terms of the CERN OHL v.2. (http://ohwr.org/CERNOHL). This documentation is distributed WITHOUT ANY EXPRESS OR IMPLIED WARRANTY, INCLUDING OF MERCHANTABILITY, SATISFACTORY QUALITY AND FITNESS FOR A PARTICULAR PURPOSE. Please see the CERN OHL v.2 for applicable conditions.
- Contact
- File
- Last Mod.
- Print Date
- Sheet
- Size
- A3
- of
- Rev
- (in symbol PMGD280UN, part A) 6(D); 2(G); 1(S)
- (in symbol PMGD280UN, part B) 3(D); 5(G); 4(S)

### Library data of the parts
C15 = CC0402_33PF_50V_1%_NP0_JOHANSON_R07S: Non-polarised capacitor; Part Description: Ultra High-Q SMD Multilayer Capacitor; Manufacturer: JOHANSON TECHNOLOGY; Manufacturer Part Number: 500R07S330FV4T; Voltage: 50V; TC: C0G/NP0; Tolerance: ±1%; Part Number: CC0402_33PF_50V_1%_NP0_JOHANSON_R07S; Component Kind: Standard; Component Type: Standard; Pin Count: 2; Value: 33pF; Status: Not Recommended; Case: 0402; Mounted: Yes; Socket: No; SMD: Yes; Sense: No; ComponentHeight: 0.61mm; HelpURL: \\cern.ch\dfs\Applications\Altium\Datasheets\CC0402_NP0_JOHANSON_R07S.pdf; Author: CERN DEM BC; CreateDate: 20.11.2017; LatestRevisionDate: 26.09.2018
C96-C109 C113-C116 C121 C123 C126 C130 C142 C146 C168 C169 C183-C186 = CC0402_100NF_16V_10%_X5R: Non-polarised capacitor; Part Description: SMD Multilayer Chip Ceramic Capacitor; Manufacturer: GENERIC; Manufacturer1 Part Number: GRM155R61C104KA88D; Voltage: 16V; TC: X5R; Tolerance: ±10%; Part Number: CC0402_100NF_16V_10%_X5R; Component Kind: Standard; Component Type: Standard; Pin Count: 2; Value: 100nF; Status: None; Manufacturer Part Number: CC0402_100NF_16V_10%_X5R; Case: 0402; Mounted: Yes; Socket: No; SMD: Yes; Sense: No; Manufacturer1 Example: MURATA; Manufacturer1 ComponentHeight: 0.55mm; HelpURL: \\cern.ch\dfs\Applications\Altium\Datasheets\CC0402_X5R_MURATA_GRM.pdf; Author: CERN DEM JLC; CreateDate: 10.12.2013; LatestRevisionDate: 10.12.2013
C110 C122 = CC0402_100PF_25V_1%_C0G: Non-polarised capacitor; Part Description: SMD Multilayer Chip Ceramic Capacitor; Manufacturer: GENERIC; Manufacturer1 Part Number: CBR04C101F3GAC; Voltage: 25V; TC: C0G/NP0; Tolerance: ±1%; Part Number: CC0402_100PF_25V_1%_C0G; Component Kind: Standard; Component Type: Standard; Pin Count: 2; Value: 100pF; Status: Not Recommended; Manufacturer Part Number: CC0402_100PF_25V_1%_C0G; Case: 0402; Mounted: Yes; Socket: No; SMD: Yes; Sense: No; Manufacturer1 Example: KEMET; Manufacturer1 ComponentHeight: 0.55mm; HelpURL: \\cern.ch\dfs\Applications\Altium\Datasheets\CC0402_C0G_KEMET_HiQ-CBR.pdf; Author: CERN DEM HF; CreateDate: 20.10.2022; LatestRevisionDate: 20.10.2022
C111 = CC0402_12PF_50V_1%_NP0_JOHANSON_R07S: Non-polarised capacitor; Part Description: Ultra High-Q SMD Multilayer Capacitor; Manufacturer: JOHANSON TECHNOLOGY; Manufacturer Part Number: 500R07S120FV4T; Voltage: 50V; TC: C0G/NP0; Tolerance: ±1%; Part Number: CC0402_12PF_50V_1%_NP0_JOHANSON_R07S; Component Kind: Standard; Component Type: Standard; Pin Count: 2; Value: 12pF; Status: Not Recommended; Case: 0402; Mounted: Yes; Socket: No; SMD: Yes; Sense: No; ComponentHeight: 0.61mm; HelpURL: \\cern.ch\dfs\Applications\Altium\Datasheets\CC0402_NP0_JOHANSON_R07S.pdf; Author: CERN DEM BC; CreateDate: 20.11.2017; LatestRevisionDate: 26.09.2018
C112 C118 C128 C137 C143-C145 = CC0603_10UF_16V_10%_X5R_MURATA_GRT188R61C106KE13: Non-polarised capacitor; Part Description: AEC-Q200 Compliant Chip Multilayer Ceramic Capacitor; Manufacturer: MURATA; Voltage: 16V; TC: X5R; Tolerance: ±10%; Part Number: CC0603_10UF_16V_10%_X5R_MURATA_GRT188R61C106KE13; Component Kind: Standard; Component Type: Standard; Pin Count: 2; Value: 10uF; Status: None; Manufacturer Part Number: GRT188R61C106KE13; Case: 0603; Mounted: Yes; Socket: No; SMD: Yes; Sense: No; ComponentHeight: 0.9mm; HelpURL: \\cern.ch\dfs\Applications\Altium\Datasheets\CC0603_MURATA_GRT188R61C106KE13.pdf; Author: CERN DEM HF; CreateDate: 16.06.2022; LatestRevisionDate: 17.06.2022
C117 C119 C129 C132-C134 C138-C141 C160-C162 C170 C199 = CC0402_1UF_16V_10%_X5R: Non-polarised capacitor; Part Description: SMD Multilayer Chip Ceramic Capacitor; Manufacturer: GENERIC; Manufacturer1 Part Number: C1005X5R1C105KT; Voltage: 16V; TC: X5R; Tolerance: ±10%; Part Number: CC0402_1UF_16V_10%_X5R; Component Kind: Standard; Component Type: Standard; Pin Count: 2; Value: 1uF; Status: Preferred; Manufacturer Part Number: CC0402_1UF_16V_10%_X5R; Case: 0402; Mounted: Yes; Socket: No; SMD: Yes; Sense: No; Manufacturer1 Example: TDK; Manufacturer1 ComponentHeight: 0.55mm; HelpURL: \\cern.ch\dfs\Applications\Altium\Datasheets\CC0402_X5R_TDK_C.pdf; Author: CERN DEM JLC; CreateDate: 25.10.2012; LatestRevisionDate: 25.10.2012
C120 C131 C182 C187 = CC0402_10NF_50V_10%_X7R: Non-polarised capacitor; Part Description: SMD Multilayer Chip Ceramic Capacitor; Manufacturer: GENERIC; Manufacturer1 Part Number: GRM155R71H103KA88D; Voltage: 50V; TC: X7R; Tolerance: ±10%; Part Number: CC0402_10NF_50V_10%_X7R; Component Kind: Standard; Component Type: Standard; Pin Count: 2; Value: 10nF; Status: None; Manufacturer Part Number: CC0402_10NF_50V_10%_X7R; Case: 0402; Mounted: Yes; Socket: No; SMD: Yes; Sense: No; Manufacturer1 Example: MURATA; Manufacturer1 ComponentHeight: 0.55mm; HelpURL: \\cern.ch\dfs\Applications\Altium\Datasheets\CC0402_X7R_MURATA_GRM.pdf; Author: CERN DEM MR; CreateDate: 08.01.2016; LatestRevisionDate: 08.01.2016
C124 = CC0402_47PF_50V_1%_C0G_MURATA_GJM1555C1H470FB01D: Non-polarised capacitor; Part Description: High-Q SMD Chip Monolithic Ceramic Capacitor; Manufacturer: MURATA; Voltage: 50V; TC: C0G/NP0; Tolerance: ±1%; Part Number: CC0402_47PF_50V_1%_C0G_MURATA_GJM1555C1H470FB01D; Component Kind: Standard; Component Type: Standard; Pin Count: 2; Value: 47pF; Status: None; Manufacturer Part Number: GJM1555C1H470FB01; Case: 0402; Mounted: Yes; Socket: No; SMD: Yes; Sense: No; ComponentHeight: 0.55mm; HelpURL: \\cern.ch\dfs\Applications\Altium\Datasheets\CC0402_MURATA_GJM1555C1H470FB01D.pdf; Author: CERN DEM BC; CreateDate: 20.11.2017; LatestRevisionDate: 20.11.2017
C125 = CC0402_3.9NF_50V_5%_X7R: Non-polarised capacitor; Part Description: SMD Multilayer Chip Ceramic Capacitor; Manufacturer: GENERIC; Manufacturer1 Part Number: CC0402JRX7R9BB392; Voltage: 50V; TC: X7R; Tolerance: ±5%; Part Number: CC0402_3.9NF_50V_5%_X7R; Component Kind: Standard; Component Type: Standard; Pin Count: 2; Value: 3.9nF; Status: Preferred; Manufacturer Part Number: CC0402_3.9NF_50V_5%_X7R; Case: 0402; Mounted: Yes; Socket: No; SMD: Yes; Sense: No; Manufacturer1 Example: YAGEO PHYCOMP; Manufacturer1 ComponentHeight: 0.55mm; HelpURL: \\cern.ch\dfs\Applications\Altium\Datasheets\CC0402_X7R_YAGEO_6.3VTO50V.pdf; Author: CERN DEM BC; CreateDate: 14.07.2020; LatestRevisionDate: 14.07.2020
C127 = CC0402_680NF_10V_10%_X5R: Non-polarised capacitor; Part Description: SMD Multilayer Chip Ceramic Capacitor; Manufacturer: GENERIC; Manufacturer1 Part Number: GRM155R61A684KE15; Voltage: 10V; TC: X5R; Tolerance: ±10%; Part Number: CC0402_680NF_10V_10%_X5R; Component Kind: Standard; Component Type: Standard; Pin Count: 2; Value: 680nF; Status: None; Manufacturer Part Number: CC0402_680NF_10V_10%_X5R; Case: 0402; Mounted: Yes; Socket: No; SMD: Yes; Sense: No; Manufacturer1 Example: MURATA; Manufacturer1 ComponentHeight: 0.55mm; HelpURL: \\cern.ch\dfs\Applications\Altium\Datasheets\CC0402_X5R_MURATA_GRM.pdf; Author: CERN DEM BC; CreateDate: 19.04.2021; LatestRevisionDate: 19.04.2021
C135 = CC0402_2.2NF_50V_10%_X7R: Non-polarised capacitor; Part Description: SMD Multilayer Chip Ceramic Capacitor; Manufacturer: GENERIC; Manufacturer1 Part Number: 223858715627; Voltage: 50V; TC: X7R; Tolerance: ±10%; Part Number: CC0402_2.2NF_50V_10%_X7R; Component Kind: Standard; Component Type: Standard; Pin Count: 2; Value: 2.2nF; Status: Not Recommended; Manufacturer Part Number: CC0402_2.2NF_50V_10%_X7R; Case: 0402; Mounted: Yes; Socket: No; SMD: Yes; Sense: No; Manufacturer1 Example: PHYCOMP; Manufacturer1 ComponentHeight: 0.55mm; HelpURL: \\cern.ch\dfs\Applications\Altium\Datasheets\CC0402_X7R_PHYCOMP.pdf; Author: CERN DEM JLC; CreateDate: 03.12.2007; LatestRevisionDate: 03.12.2007
C136 = CC0402_82PF_25V_1%_C0G_KEMET_HiQ-CBR: Non-polarised capacitor; Part Description: High Q and low ESR, SMD Multilayer Chip Ceramic Capacitor, HiQ-CBR Series; Manufacturer: KEMET; Manufacturer Part Number: CBR04C820F3GAC; Voltage: 25V; TC: C0G/NP0; Tolerance: ±1%; Part Number: CC0402_82PF_25V_1%_C0G_KEMET_HiQ-CBR; Component Kind: Standard; Component Type: Standard; Pin Count: 2; Value: 82pF; Status: Not Recommended; Case: 0402; Mounted: Yes; Socket: No; SMD: Yes; Sense: No; ComponentHeight: 0.55mm; HelpURL: \\cern.ch\dfs\Applications\Altium\Datasheets\CC0402_C0G_KEMET_HiQ-CBR.pdf; Author: CERN DEM MR; CreateDate: 17.11.2017; LatestRevisionDate: 21.11.2017
IC7 = LMK04828BISQ/NOPB: Ultra Low-Noise Clock Jitter Cleaner with Dual Loop PLLs; Manufacturer: TEXAS INSTRUMENTS; PressFit: No; Bonding: No; Part Number: LMK04828BISQ/NOPB; Component Kind: Standard; Component Type: Standard; Device: LMK04828BISQ/NOPB; PackageDescription: QFN, 0.50mm Pitch, Square; 64 Pin, 9.00mm L X 9.00mm W X 0.80mm H body (w/Thermal Tab 7.30 X 7.30mm), IPC Medium Density; Part Description: Ultra Low-Noise Clock Jitter Cleaner with Dual Loop PLLs; Manufacturer Part Number: LMK04828BISQ; Pin Count: 65; Case: QFN64; Mounted: Yes; Socket: No; SMD: Yes; Sense: No; ComponentHeight: 0.8mm; Author: CERN DEM MR; HelpURL: \\cern.ch\dfs\Applications\Altium\Datasheets\LMK04828BISQ-NOPB.pdf; CreateDate: 08.08.2019; LatestRevisionDate: 01.06.2022
IC8 = LP5900SD-3.3: Ultra Low Noise, 150 mA Linear Regulator for RF/Analog Circuits Requires No Bypass Capacitor; Part Description: 3.3V,150mA Ultra Low Noise, Linear Regulator for RF/Analog Circuits Requires No Bypass Capacitor; Manufacturer: TEXAS INSTRUMENTS; PressFit: No; Part Number: LP5900SD-3.3; Component Kind: Standard; Component Type: Standard; Device: LP5900SD-3.3; PackageDescription: SON, 0.65mm Pitch; 6 Pin, 2.50mm W X 2.20mm L X 0.80mm H body (w/Thermal Tab 0.75 X 1.20mm),  IPC Medium Density; Manufacturer Part Number: LP5900SD-3.3; Pin Count: 7; Case: SON6; Mounted: Yes; Socket: No; SMD: Yes; Sense: No; Bonding: No; ComponentHeight: 0.8mm; HelpURL: \\cern.ch\dfs\Applications\Altium\Datasheets\LP5900SD.pdf; Author: CERN DEM JLC; CreateDate: 26.09.2011; LatestRevisionDate: 29.01.2021
IC9 = TPS7A8101DRB: 0.8V to 6V, 1A, Low-Noise, Wide-Bandwidth, High PSRR, Low-Dropout Linear Regulator; Manufacturer: TEXAS INSTRUMENTS; PressFit: No; Bonding: No; Part Number: TPS7A8101DRB; Component Kind: Standard; Component Type: Standard; Device: TPS7A8101DRB; PackageDescription: TEXAS Case Style DRB (S-PVSON-N8), SON, 0.65mm Pitch; 8 Pin, 3.00mm W X 3.00mm L X 1.00mm H body (w/Thermal Tab 1.60 X 1.85mm); Part Description: 0.8V to 6V, 1A, Low-Noise, Wide-Bandwidth, High PSRR, Low-Dropout Linear Regulator; Manufacturer Part Number: TPS7A8101DRB; Pin Count: 9; Case: SON8; Mounted: Yes; Socket: No; SMD: Yes; Sense: No; ComponentHeight: 1mm; HelpURL: \\cern.ch\dfs\Applications\Altium\Datasheets\TPS7A8101DRB.pdf; Author: CERN DEM BC; CreateDate: 18.02.2019; LatestRevisionDate: 18.02.2019
IC16 IC17 = SN74AVC4T245RSVR: 4-Bit Dual-Supply Bus Transceiver with Configurable Voltage Translation and 3-State Output; Part Description: 4-Bit Dual-Supply Bus Transceiver with Configurable Voltage Translation and 3-State Outputs; Manufacturer: TEXAS INSTRUMENTS; PressFit: No; Bonding: No; Part Number: SN74AVC4T245RSVR; Component Kind: Standard; Component Type: Standard; Device: SN74AVC4T245RSVR; PackageDescription: QFN, 0.40mm Pitch, Rect.; 16 Pin, 2.60mm L X 1.80mm W X 0.55mm H Body, IPC Medium Density; Status: Not Recommended; Manufacturer Part Number: SN74AVC4T245RSVR; Pin Count: 16; Case: QFN16; Mounted: Yes; Socket: No; SMD: Yes; Sense: No; ComponentHeight: 0.55mm; Author: CERN DEM JLC; HelpURL: \\cern.ch\dfs\Applications\Altium\Datasheets\SN74AVC4T245RSVR.pdf; CreateDate: 08.07.2014; LatestRevisionDate: 30.03.2017
L7 L19 = IND0603_MURATA_BLM18KG102SN1: Part Description: SMD Chip Ferrite Bead, Automotive; Manufacturer: MURATA; Manufacturer Part Number: BLM18KG102WH1; Power: 1A; Resistance: 0.2R; Tolerance: ±25%; Part Number: IND0603_MURATA_BLM18KG102SN1; Component Kind: Standard; Component Type: Standard; Pin Count: 2; Value: 1000R@100MHz; Case: 0603; Mounted: Yes; Socket: No; SMD: Yes; Sense: No; ComponentHeight: 0.95mm; HelpURL: \\cern.ch\dfs\Applications\Altium\Datasheets\IND0603_MURATA_BLM18KG102SN1.pdf; Author: CERN DEM HF; CreateDate: 15.12.2022; LatestRevisionDate: 15.12.2022
L8-L18 L26 L39 L42 L43 = IND0402_MURATA_BLM15PX121SN1D: Part Description: SMD EMIFIL Chip Ferrite Bead; Manufacturer: MURATA; Power: 2A; Resistance: 0.055R; Tolerance: ±25%; Part Number: IND0402_MURATA_BLM15PX121SN1D; Component Kind: Standard; Component Type: Standard; Pin Count: 2; Value: 120R@100MHz; Manufacturer Part Number: BLM15PX121SN1D; Case: 0402; Mounted: Yes; Socket: No; SMD: Yes; Sense: No; ComponentHeight: 0.55mm; HelpURL: \\cern.ch\dfs\Applications\Altium\Datasheets\IND0402_MURATA_BLM15PX.pdf; Author: CERN DEM JMW; CreateDate: 19.02.2014; LatestRevisionDate: 25.10.2018
OSC1 = OSC_125MHZ_SI-TIME_SIT9121AI-2C2-33E125.000000: Standard Frequency Differential Oscillator; Part Description: 3.3V, ±25ppm, -40..85°C, 3.2x5.0mm Surface Mount LVDS High Performance Differential Oscillator (SIT9121 Series); Manufacturer: SI TIME; PressFit: No; Bonding: No; Part Number: OSC_125MHZ_SI-TIME_SIT9121AI-2C2-33E125.000000; Component Kind: Standard; Component Type: Standard; PackageDescription: SiT9121 Series Package C, Oscillators, Version 3.2.0mm x 5.0mm, Pitch 1.27mm; 6 Pin; Value: 125MHz; Manufacturer Part Number: SIT9121AI-2C2-33E125.000000; Pin Count: 6; Mounted: Yes; Socket: No; SMD: Yes; Sense: No; ComponentHeight: 0.8mm; HelpURL: \\cern.ch\dfs\Applications\Altium\Datasheets\OSC_SI-TIME_SIT9121.pdf; Author: CERN DEM HF; CreateDate: 06.12.2024; LatestRevisionDate: 06.12.2024
OSC2 = OSC_122.880MHZ_ABRACON_ASG-D-V-A-122.880MHZ: Programmable - High Performance SMD VCXO; Part Description: 3.3V, Stability: ±35ppm, -40°C to +85°C, Programmable - High Performance SMD VCXO, LVDS Output, ASG-D Series; PressFit: No; Bonding: No; Part Number: OSC_122.880MHZ_ABRACON_ASG-D-V-A-122.880MHZ; Component Kind: Standard; Component Type: Standard; PackageDescription: SMD Oscillator, Side Concave; 2.54mm Pitch; 6 Pins, 5.00mm L X 7.00mm W X 1.90mm H, IPC Medium Density; Value: 122.880MHZ; Manufacturer: ABRACON; Manufacturer Part Number: ASG-D-V-A-122.880MHZ; Pin Count: 6; Mounted: Yes; Socket: No; SMD: Yes; Sense: No; ComponentHeight: 1.9mm; HelpURL: \\cern.ch\dfs\Applications\Altium\Datasheets\OSC_ABRACON_ASG-D.pdf; Author: CERN DEM HF; CreateDate: 26.10.2021; LatestRevisionDate: 26.10.2021
R27 = R0402_470R_1%_0.0625W_100PPM: Resistor - 1%; Part Description: General Purpose Thick Film Chip Resistor; Manufacturer: GENERIC; Manufacturer1 Part Number: 232270674701L; TC: ±100ppm/°C; PressFit: No; Part Number: R0402_470R_1%_0.0625W_100PPM; Component Kind: Standard; Component Type: Standard; Pin Count: 2; Value: 470; Status: Not Recommended; Power: 0.0625W; Manufacturer Part Number: R0402_470R_1%_0.0625W_100PPM; Case: 0402; Mounted: Yes; Sense: No; Socket: No; SMD: Yes; Manufacturer1 Example: YAGEO PHYCOMP; Manufacturer1 ComponentHeight: 0.4mm; HelpURL: \\cern.ch\dfs\Applications\Altium\Datasheets\R0402_Phycomp_RC0402.pdf; Author: CERN DEM JLC; CreateDate: 03.12.2007; LatestRevisionDate: 17.10.2012
R28 R31 R58 = R0402_49R9_1%_0.0625W_100PPM: Resistor - 1%; Part Description: General Purpose Thick Film Chip Resistor; Manufacturer: GENERIC; Manufacturer1 Part Number: 232270674999L or RC0402FR-0749R9L; TC: ±100ppm/°C; PressFit: No; Part Number: R0402_49R9_1%_0.0625W_100PPM; Component Kind: Standard; Component Type: Standard; Pin Count: 2; Value: 49R9; Status: Not Recommended; Power: 0.0625W; Manufacturer Part Number: R0402_49R9_1%_0.0625W_100PPM; Case: 0402; Mounted: Yes; Sense: No; Socket: No; SMD: Yes; Manufacturer1 Example: YAGEO PHYCOMP; Manufacturer1 ComponentHeight: 0.4mm; HelpURL: \\cern.ch\dfs\Applications\Altium\Datasheets\R0402_Phycomp_RC0402.pdf; Author: CERN DEM JLC; CreateDate: 24.10.2012; LatestRevisionDate: 24.10.2012
R29 R30 R32 R35 R36 = R0402_560R_1%_0.0625W_100PPM: Resistor - 1%; Part Description: General Purpose Thick Film Chip Resistor; Manufacturer: GENERIC; Manufacturer1 Part Number: 232270675601L; TC: ±100ppm/°C; PressFit: No; Part Number: R0402_560R_1%_0.0625W_100PPM; Component Kind: Standard; Component Type: Standard; Pin Count: 2; Value: 560; Status: Not Recommended; Power: 0.0625W; Manufacturer Part Number: R0402_560R_1%_0.0625W_100PPM; Case: 0402; Mounted: Yes; Sense: No; Socket: No; SMD: Yes; Manufacturer1 Example: YAGEO PHYCOMP; Manufacturer1 ComponentHeight: 0.4mm; HelpURL: \\cern.ch\dfs\Applications\Altium\Datasheets\R0402_Phycomp_RC0402.pdf; Author: CERN DEM JLC; CreateDate: 03.12.2007; LatestRevisionDate: 17.10.2012
R33 R37 = R0402_100R_1%_0.0625W_100PPM: Resistor - 1%; Part Description: General Purpose Thick Film Chip Resistor; Manufacturer: GENERIC; Manufacturer1 Part Number: 232270671001L; TC: ±100ppm/°C; PressFit: No; Part Number: R0402_100R_1%_0.0625W_100PPM; Component Kind: Standard; Component Type: Standard; Pin Count: 2; Value: 100; Status: Not Recommended; Power: 0.0625W; Manufacturer Part Number: R0402_100R_1%_0.0625W_100PPM; Case: 0402; Mounted: Yes; Sense: No; Socket: No; SMD: Yes; Manufacturer1 Example: YAGEO PHYCOMP; Manufacturer1 ComponentHeight: 0.4mm; HelpURL: \\cern.ch\dfs\Applications\Altium\Datasheets\R0402_Phycomp_RC0402.pdf; Author: CERN DEM JLC; CreateDate: 03.12.2007; LatestRevisionDate: 17.10.2012
R34 R55 R91-R94 = R0402_10K_1%_0.0625W_100PPM: Resistor - 1%; Part Description: General Purpose Thick Film Chip Resistor; Manufacturer: GENERIC; Manufacturer1 Part Number: 232270671003L; TC: ±100ppm/°C; PressFit: No; Part Number: R0402_10K_1%_0.0625W_100PPM; Component Kind: Standard; Component Type: Standard; Pin Count: 2; Value: 10k; Status: Not Recommended; Power: 0.0625W; Manufacturer Part Number: R0402_10K_1%_0.0625W_100PPM; Case: 0402; Mounted: Yes; Sense: No; Socket: No; SMD: Yes; Manufacturer1 Example: YAGEO PHYCOMP; Manufacturer1 ComponentHeight: 0.4mm; HelpURL: \\cern.ch\dfs\Applications\Altium\Datasheets\R0402_Phycomp_RC0402.pdf; Author: CERN DEM JLC; CreateDate: 03.12.2007; LatestRevisionDate: 17.10.2012
R38 = R0402_620R_1%_0.0625W_100PPM: Resistor - 1%; Part Description: General Purpose Thick Film Chip Resistor; Manufacturer: GENERIC; Manufacturer1 Part Number: 232270676201L; TC: ±100ppm/°C; PressFit: No; Part Number: R0402_620R_1%_0.0625W_100PPM; Component Kind: Standard; Component Type: Standard; Pin Count: 2; Value: 620; Status: Not Recommended; Power: 0.0625W; Manufacturer Part Number: R0402_620R_1%_0.0625W_100PPM; Case: 0402; Mounted: Yes; Sense: No; Socket: No; SMD: Yes; Manufacturer1 Example: YAGEO PHYCOMP; Manufacturer1 ComponentHeight: 0.4mm; HelpURL: \\cern.ch\dfs\Applications\Altium\Datasheets\R0402_Phycomp_RC0402.pdf; Author: CERN DEM JLC; CreateDate: 03.12.2007; LatestRevisionDate: 17.10.2012
R39 R59 = R0402_39K_1%_0.0625W_100PPM: Resistor - 1%; Part Description: General Purpose Thick Film Chip Resistor; Manufacturer: GENERIC; Manufacturer1 Part Number: 232270673903; TC: ±100ppm/°C; PressFit: No; Part Number: R0402_39K_1%_0.0625W_100PPM; Component Kind: Standard; Component Type: Standard; Pin Count: 2; Value: 39k; Status: Not Recommended; Power: 0.0625W; Manufacturer Part Number: R0402_39K_1%_0.0625W_100PPM; Case: 0402; Mounted: Yes; Sense: No; Socket: No; SMD: Yes; Manufacturer1 Example: YAGEO PHYCOMP; Manufacturer1 ComponentHeight: 0.4mm; HelpURL: \\cern.ch\dfs\Applications\Altium\Datasheets\R0402_Phycomp_RC0402.pdf; Author: CERN DEM JLC; CreateDate: 03.12.2007; LatestRevisionDate: 17.10.2012
R40 = R0402_5K6_1%_0.0625W_100PPM: Resistor - 1%; Part Description: General Purpose Thick Film Chip Resistor; Manufacturer: GENERIC; Manufacturer1 Part Number: 232270675602L; TC: ±100ppm/°C; PressFit: No; Part Number: R0402_5K6_1%_0.0625W_100PPM; Component Kind: Standard; Component Type: Standard; Pin Count: 2; Value: 5k6; Status: Not Recommended; Power: 0.0625W; Manufacturer Part Number: R0402_5K6_1%_0.0625W_100PPM; Case: 0402; Mounted: Yes; Sense: No; Socket: No; SMD: Yes; Manufacturer1 Example: YAGEO PHYCOMP; Manufacturer1 ComponentHeight: 0.4mm; HelpURL: \\cern.ch\dfs\Applications\Altium\Datasheets\R0402_Phycomp_RC0402.pdf; Author: CERN DEM JLC; CreateDate: 03.12.2007; LatestRevisionDate: 17.10.2012
R41 = R0402_1K8_1%_0.0625W_100PPM: Resistor - 1%; Part Description: General Purpose Thick Film Chip Resistor; Manufacturer: GENERIC; Manufacturer1 Part Number: 232270671802L; TC: ±100ppm/°C; PressFit: No; Part Number: R0402_1K8_1%_0.0625W_100PPM; Component Kind: Standard; Component Type: Standard; Pin Count: 2; Value: 1k8; Status: Not Recommended; Power: 0.0625W; Manufacturer Part Number: R0402_1K8_1%_0.0625W_100PPM; Case: 0402; Mounted: Yes; Sense: No; Socket: No; SMD: Yes; Manufacturer1 Example: YAGEO PHYCOMP; Manufacturer1 ComponentHeight: 0.4mm; HelpURL: \\cern.ch\dfs\Applications\Altium\Datasheets\R0402_Phycomp_RC0402.pdf; Author: CERN DEM JLC; CreateDate: 03.12.2007; LatestRevisionDate: 17.10.2012
T2 = PMGD280UN: Dual N-Channel micro TrenchMOS™ Ultra Low Level FET; Part Description: 20V 870mA Dual N-Channel micro TrenchMOS™ Ultra Low Level FET; Manufacturer: NXP SEMICONDUCTORS; PressFit: No; Bonding: No; Part Number: PMGD280UN; Component Kind: Standard; Component Type: Standard; Device: PMGD280UN; PackageDescription: SOT363, SC70-6, 0.65mm Pitch; 6 Pin, 1.25mm W X 2.00mm L X 1.10mm H body, IPC Medium Density; Manufacturer Part Number: PMGD280UN; Pin Count: 6; Case: SOT363; Mounted: Yes; Socket: No; SMD: Yes; Sense: No; ComponentHeight: 1.1mm; HelpURL: \\cern.ch\dfs\Applications\Altium\Datasheets\PMGD280UN.pdf; Author: CERN DEM JLC; CreateDate: 19.11.2014; LatestRevisionDate: 19.11.2014